# Altium schematic sheet 0_ADSTM32-Overview.SchDoc
size A; SheetNumber: 1; SheetTotal: 4
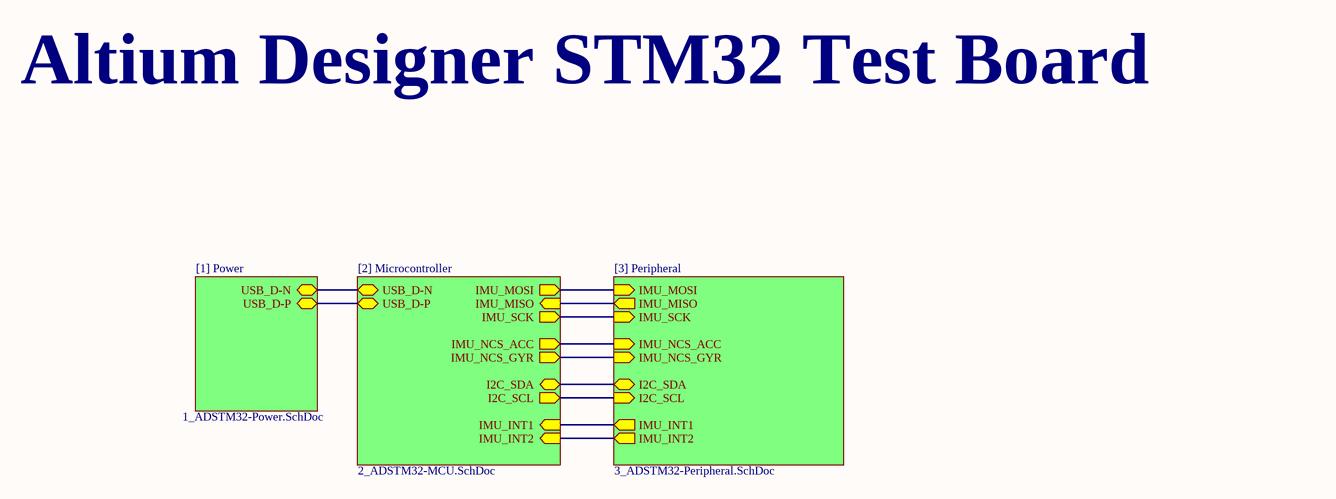
[diagram p0: 0_ADSTM32-Overview.SchDoc]

## Sub-sheets
[1] Power = 1_ADSTM32-Power.SchDoc: USB_D-N (bidir), USB_D-P (bidir)
[2] Microcontroller = 2_ADSTM32-MCU.SchDoc: USB_D-N (bidir), USB_D-P (bidir), IMU_NCS_ACC (out), IMU_NCS_GYR (out), IMU_SCK (out), IMU_MOSI (out), IMU_MISO (in), I2C_SCL (out), I2C_SDA (bidir), IMU_INT1 (in), IMU_INT2 (in)
[3] Peripheral = 3_ADSTM32-Peripheral.SchDoc: IMU_SCK (in), IMU_MOSI (in), IMU_MISO (out), IMU_NCS_ACC (in), IMU_NCS_GYR (in), I2C_SCL (in), I2C_SDA (bidir), IMU_INT1 (out), IMU_INT2 (out)

## Nets
(unnamed): sheet [1] Power/USB_D-N, sheet [2] Microcontroller/USB_D-N
(unnamed): sheet [1] Power/USB_D-P, sheet [2] Microcontroller/USB_D-P
(unnamed): sheet [3] Peripheral/IMU_SCK, sheet [2] Microcontroller/IMU_SCK
(unnamed): sheet [3] Peripheral/IMU_MOSI, sheet [2] Microcontroller/IMU_MOSI
(unnamed): sheet [3] Peripheral/IMU_MISO, sheet [2] Microcontroller/IMU_MISO
(unnamed): sheet [3] Peripheral/IMU_NCS_ACC, sheet [2] Microcontroller/IMU_NCS_ACC
(unnamed): sheet [3] Peripheral/IMU_NCS_GYR, sheet [2] Microcontroller/IMU_NCS_GYR
(unnamed): sheet [3] Peripheral/I2C_SCL, sheet [2] Microcontroller/I2C_SCL
(unnamed): sheet [3] Peripheral/I2C_SDA, sheet [2] Microcontroller/I2C_SDA
(unnamed): sheet [3] Peripheral/IMU_INT1, sheet [2] Microcontroller/IMU_INT1
(unnamed): sheet [3] Peripheral/IMU_INT2, sheet [2] Microcontroller/IMU_INT2

## Notes on the sheet
- Altium Designer STM32 Test Board